# Altium schematic sheet WebCamera.schdoc
size 300 x 207 mm
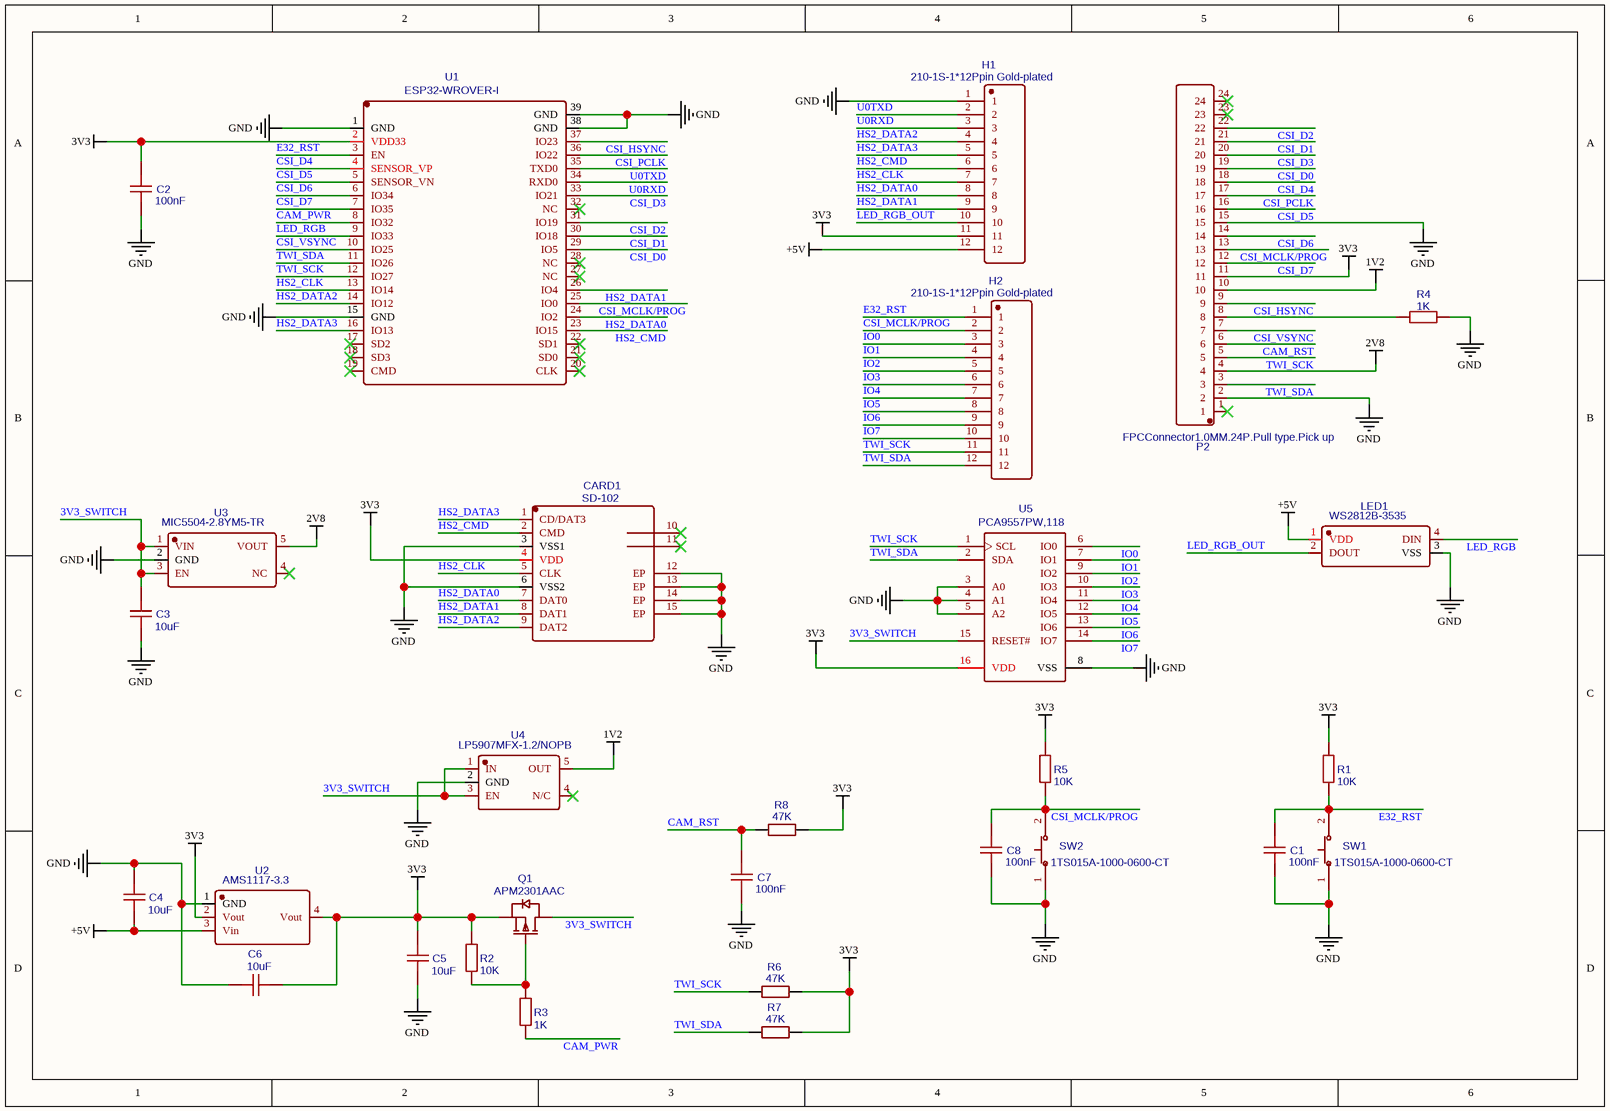
[diagram p0: WebCamera.schdoc]

## Parts
C1  100nF  [C0402]
C2  100nF  [C0402]
C3  10uF  [C0603]
C4  10uF  [C0603]
C5  10uF  [C0603]
C6  10uF  [C0603]
C7  100nF  [C0402]
C8  100nF  [C0402]
CARD1  SD-102  [SIM-SMD_SD-102]
H1  210-1S-1*12Ppin Gold-plated  [HDR-TH_12P-P1.27-V]
H2  210-1S-1*12Ppin Gold-plated  [HDR-TH_12P-P1.27-V]
LED1  WS2812B-3535  [LED-SMD_4P-L3.5-W3.5-TL_WS2812B]
P2  FPCConnector1.0MM.24P.Pull type.Pick up  [FPC-SMD_24P-L31.5-W5.6-P1.00]
Q1  APM2301AAC  [SC-59-3_L2.9-W1.6-P0.95-LS2.9-BR]
R1  10K  [R0805]
R2  10K  [R0805]
R3  1K  [R0805]
R4  1K  [R0805]
R5  10K  [R0805]
R6  47K  [R0805]
R7  47K  [R0805]
R8  47K  [R0805]
SW1  1TS015A-1000-0600-CT  [KEY-SMD_L3.0-W2.0-LS3.5]
SW2  1TS015A-1000-0600-CT  [KEY-SMD_L3.0-W2.0-LS3.5]
U1  ESP32-WROVER-I  [WIFIM-SMD_ESP32-WROVER-I]
U2  AMS1117-3.3  [SOT-223-3_L6.5-W3.4-P2.30-LS7.0-BR]
U3  MIC5504-2.8YM5-TR  [SOT-23-5_L3.0-W1.7-P0.95-LS2.8-BL]
U4  LP5907MFX-1.2/NOPB  [SOT-23-5_L3.0-W1.7-P0.95-LS2.8-BR]
U5  PCA9557PW,118  [TSSOP-16_L5.0-W4.4-P0.65-LS6.4-BL]

## Nets
1V2: P2.10 U4.5(OUT)
2V8: P2.4 U3.5(VOUT)
3V3: C2.1 C5.2 C6.1 CARD1.4(VDD) H1.11 P2.11 Q1.2(S) R1.2 R2.2 R5.2 R6.2 R7.2 R8.2 U1.2(VDD33) U2.2(Vout) U2.4(Vout) U5.16(VDD)
+5V: C4.1 H1.12 LED1.1(VDD) U2.3(Vin)
GND: C1.2 C2.2 C3.1 C4.2 C5.1 C6.2 C7.2 C8.2 CARD1.3(VSS1) CARD1.6(VSS2) CARD1.12(EP) CARD1.13(EP) CARD1.14(EP) CARD1.15(EP) H1.1 LED1.3(VSS) P2.2 P2.15 R4.1 SW1.1 SW2.1 U1.1(GND) U1.15(GND) U1.38(GND) U1.39(GND) U2.1(GND) U3.2(GND) U4.2(GND) U5.3(A0) U5.4(A1) U5.5(A2) U5.8(VSS)
3V3_SWITCH: C3.2 Q1.3(D) U3.1(VIN) U3.3(EN) U4.1(IN) U4.3(EN) U5.15(RESET#)
CAM_PWR: R3.1 U1.8(IO32)
CAM_RST: C7.1 P2.6 R8.1
CSI_D0: P2.19 U1.29(IO5)
CSI_D1: P2.21 U1.30(IO18)
CSI_D2: P2.22 U1.31(IO19)
CSI_D3: P2.20 U1.33(IO21)
CSI_D4: P2.18 U1.4(SENSOR_VP)
CSI_D5: P2.16 U1.5(SENSOR_VN)
CSI_D6: P2.14 U1.6(IO34)
CSI_D7: P2.12 U1.7(IO35)
CSI_HSYNC: P2.9 U1.37(IO23)
CSI_MCLK/PROG: C8.1 H2.2 P2.13 R5.1 SW2.2 U1.25(IO0)
CSI_PCLK: P2.17 U1.36(IO22)
CSI_VSYNC: P2.7 U1.10(IO25)
E32_RST: C1.1 H2.1 R1.1 SW1.2 U1.3(EN)
HS2_CLK: CARD1.5(CLK) H1.7 U1.13(IO14)
HS2_CMD: CARD1.2(CMD) H1.6 U1.23(IO15)
HS2_DATA0: CARD1.7(DAT0) H1.8 U1.24(IO2)
HS2_DATA1: CARD1.8(DAT1) H1.9 U1.26(IO4)
HS2_DATA2: CARD1.9(DAT2) H1.4 U1.14(IO12)
HS2_DATA3: CARD1.1(CD/DAT3) H1.5 U1.16(IO13)
IO0: H2.3 U5.6(IO0)
IO1: H2.4 U5.7(IO1)
IO2: H2.5 U5.9(IO2)
IO3: H2.6 U5.10(IO3)
IO4: H2.7 U5.11(IO4)
IO5: H2.8 U5.12(IO5)
IO6: H2.9 U5.13(IO6)
IO7: H2.10 U5.14(IO7)
LED_RGB: LED1.4(DIN) U1.9(IO33)
LED_RGB_OUT: H1.10 LED1.2(DOUT)
TWI_SCK: H2.11 P2.5 R6.1 U1.12(IO27) U5.1(SCL)
TWI_SDA: H2.12 P2.3 R7.1 U1.11(IO26) U5.2(SDA)
U0RXD: H1.3 U1.34(RXD0)
U0TXD: H1.2 U1.35(TXD0)
NetP2_8: P2.8 R4.2
NetQ1_1: Q1.1(G) R2.1 R3.2

Not connected (* = marked no-connect by the designer): CARD1 10* 11*; P2 1* 23* 24*; U1 17(SD2)* 18(SD3)* 19(CMD)* 20(CLK)* 21(SD0)* 22(SD1)* 27(NC)* 28(NC)* 32(NC)*; U3 4(NC)*; U4 4(N/C)*

## Library data of the parts
C1 C2 C7 C8 = 100nF: BOM_Manufacturer: Samsung Electro-Mechanics; BOM_Manufacturer Part: CL05B104KB54PNC; nameAlias: Capacitance; Contributor: LCSC; SMT Type: Extend; BOM_Supplier: LCSC; BOM_Supplier Part: C307331; BOM_LCSC Assembly: Yes; spicePre: C; spiceSymbolName: CL05B104KB54PNC
C3-C6 = 10uF: BOM_Manufacturer: SAMSUNG; BOM_Manufacturer Part: CL10A106KP8NNNC; nameAlias: Capacitance; SMT Type: Basic; BOM_Supplier: LCSC; BOM_LCSC Assembly: Yes; BOM_Supplier Part: C19702; spicePre: C; spiceSymbolName: CL10A106KP8NNNC
CARD1 = SD-102: BOM_Manufacturer: XUNPU; Contributor: LCSC; BOM_Supplier: LCSC; BOM_Supplier Part: C266602; BOM_Manufacturer Part: SD-102; spicePre: C; spiceSymbolName: SD-102
H1 H2 = 210-1S-1*12Ppin Gold-plated: BOM_Manufacturer: Ckmtw; Contributor: LCSC; BOM_Supplier: LCSC; BOM_Manufacturer Part: 210-1S-1*12Ppin Gold-plated; BOM_Supplier Part: C124353; spicePre: H; spiceSymbolName: 210-1S-1*12Ppin Gold-plated
LED1 = WS2812B-3535: BOM_Manufacturer: Worldsemi; Contributor: LCSC; SMT Type: Extend; BOM_Supplier: LCSC; BOM_Manufacturer Part: WS2812B-3535; BOM_Supplier Part: C114583; BOM_LCSC Assembly: Yes; spicePre: L; spiceSymbolName: WS2812B-3535
P2 = FPCConnector1.0MM.24P.Pull type.Pick up: BOM_Manufacturer: BOOMELE; spicePre: X; BOM_Supplier: LCSC; BOM_Manufacturer Part: FPCConnector1.0MM.24P.Pull type.Pick up; image: //image.lceda.cn/szlcsc/C34750.jpg; BOM_Supplier Part: C34750; spiceSymbolName: FPCConnector1.0MM.24P.Pull type.Pick up
Q1 = APM2301AAC: BOM_Manufacturer: Shikues; Contributor: LCSC; BOM_Supplier: LCSC; BOM_Supplier Part: C475607; BOM_Manufacturer Part: APM2301AAC; spicePre: Q; spiceSymbolName: APM2301AAC
R1 R2 R5 = 10K: BOM_Manufacturer: SANYEAR; BOM_Manufacturer Part: SY0805JN10KP; nameAlias: Resistance (Ohms); Contributor: LCSC; BOM_Supplier: LCSC; BOM_Supplier Part: C380776; spicePre: R; spiceSymbolName: SY0805JN10KP_C380776
R3 R4 = 1K: BOM_Manufacturer: ResistorToday; BOM_Manufacturer Part: AECR0805F1K00K9; nameAlias: Resistance (Ohms); Contributor: LCSC; BOM_Supplier: LCSC; BOM_Supplier Part: C328385; spicePre: R; spiceSymbolName: AECR0805F1K00K9
R6-R8 = 47K: BOM_Manufacturer: LIZ; BOM_Manufacturer Part: CR0805J80473G; nameAlias: Resistance (Ohms); SMT Type: Extend; BOM_Supplier: LCSC; BOM_Supplier Part: C102018; BOM_LCSC Assembly: Yes; spicePre: R; spiceSymbolName: CR0805J80473G
SW1 SW2 = 1TS015A-1000-0600-CT: BOM_Manufacturer: HYP (Hongyuan Precision); Contributor: LCSC; BOM_Supplier: LCSC; BOM_Supplier Part: C398744; BOM_Manufacturer Part: 1TS015A-1000-0600-CT; spicePre: S; spiceSymbolName: 1TS015A-1000-0600-CT
U1 = ESP32-WROVER-I: BOM_Manufacturer: Espressif Systems; Contributor: LCSC; BOM_Supplier: LCSC; BOM_Supplier Part: C132370; BOM_Manufacturer Part: ESP32-WROVER-I; spicePre: U; spiceSymbolName: ESP32-WROVER-I
U2 = AMS1117-3.3: BOM_Manufacturer: AMS; sourceId: dwIGgezVh; SMT Type: Basic; timeStamp: 1476261164; BOM_Supplier: LCSC; BOM_Manufacturer Part: AMS1117-3.3; BOM_LCSC Assembly: Yes; image: //image.lceda.cn/szlcsc/C6186.jpg; BOM_Supplier Part: C6186; spicePre: U; spiceSymbolName: AMS1117-3.3
U3 = MIC5504-2.8YM5-TR: BOM_Manufacturer: Microchip Tech; Contributor: LCSC; SMT Type: Extend; BOM_Supplier: LCSC; BOM_Supplier Part: C95749; BOM_Manufacturer Part: MIC5504-2.8YM5-TR; BOM_LCSC Assembly: Yes; spicePre: U; spiceSymbolName: MIC5504-2.8YM5-TR
U4 = LP5907MFX-1.2/NOPB: BOM_Manufacturer: Texas Instruments; Contributor: LCSC; SMT Type: Extend; BOM_Supplier: LCSC; BOM_Supplier Part: C73478; BOM_Manufacturer Part: LP5907MFX-1.2/NOPB; BOM_LCSC Assembly: Yes; spicePre: U; spiceSymbolName: LP5907MFX-1.2/NOPB
U5 = PCA9557PW,118: BOM_Manufacturer: NXP; Contributor: LCSC; SMT Type: Extend; BOM_Supplier: LCSC; BOM_Manufacturer Part: PCA9557PW,118; BOM_Supplier Part: C141380; BOM_LCSC Assembly: Yes; spicePre: U; spiceSymbolName: PCA9557PW,118